# Altium project Main_PCB_EDR.PrjPcb
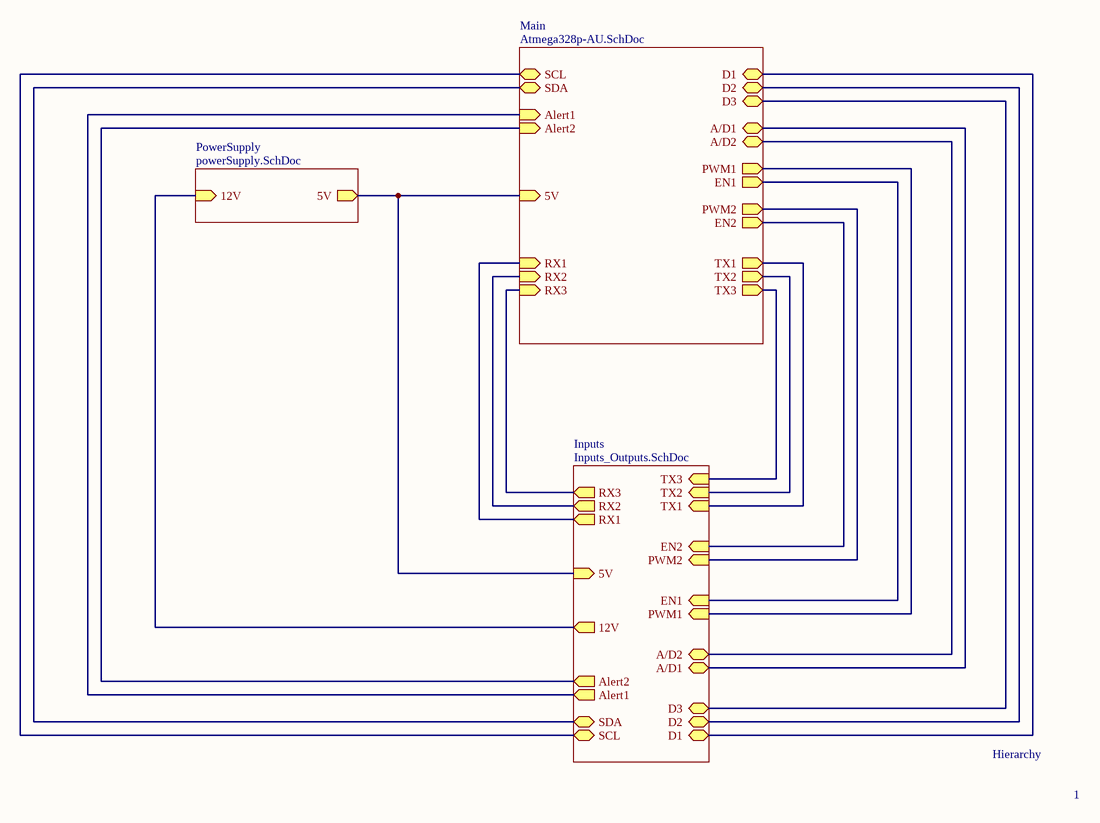
[diagram p0: Hierarchy.SchDoc]
4 sheets, 28 parts. Net scope: hierarchical (ports join the sheet entries above them; power ports are global).
Board file: PCB2.PcbDoc
Sheets:
  Hierarchy.SchDoc
    Main = Atmega328p-AU.SchDoc
    PowerSupply = powerSupply.SchDoc
    Inputs = Inputs_Outputs.SchDoc

## Sheet Hierarchy.SchDoc
size A4; SheetNumber: 1; SheetTotal: 4

### Sub-sheets
Inputs = Inputs_Outputs.SchDoc: Alert1 (out), Alert2 (out), 12V (out), SCL (bidir), SDA (bidir), TX3 (in), TX2 (in), TX1 (in), EN2 (in), PWM2 (in), EN1 (in), PWM1 (in), A/D2 (bidir), A/D1 (bidir), D3 (bidir), D2 (bidir), D1 (bidir), 5V (in), RX1 (out), RX2 (out), RX3 (out)
Main = Atmega328p-AU.SchDoc: PWM1 (out), EN1 (out), PWM2 (out), EN2 (out), 5V (in), Alert1 (in), Alert2 (in), SCL (bidir), SDA (bidir), RX1 (in), RX2 (in), RX3 (in), TX1 (out), TX2 (out), TX3 (out), D2 (bidir), D3 (bidir), D1 (bidir), A/D1 (bidir), A/D2 (bidir)
PowerSupply = powerSupply.SchDoc: 5V (out), 12V (in)

### Nets
+5: sheet Main/5V, sheet PowerSupply/5V, sheet Inputs/5V
NetA/D_1: sheet Main/A/D1, sheet Inputs/A/D1
NetA/D_2: sheet Main/A/D2, sheet Inputs/A/D2
NetC2_1: sheet PowerSupply/12V, sheet Inputs/12V
Netcurrent_sensor_1_1: sheet Main/SCL, sheet Inputs/SCL
Netcurrent_sensor_1_2: sheet Main/SDA, sheet Inputs/SDA
Netcurrent_sensor_1_3: sheet Main/Alert1, sheet Inputs/Alert1
Netcurrent_sensor_2_3: sheet Main/Alert2, sheet Inputs/Alert2
NetDigital_1: sheet Main/D1, sheet Inputs/D1
NetDigital_2: sheet Main/D2, sheet Inputs/D2
NetDigital_3: sheet Main/D3, sheet Inputs/D3
NetH-Bridge1_1: sheet Main/PWM1, sheet Inputs/PWM1
NetH-Bridge1_2: sheet Main/EN1, sheet Inputs/EN1
NetH-Bridge2_1: sheet Main/PWM2, sheet Inputs/PWM2
NetH-Bridge2_2: sheet Main/EN2, sheet Inputs/EN2
NetIC1_23: sheet Main/RX1, sheet Inputs/RX1
NetIC1_24: sheet Main/TX1, sheet Inputs/TX1
NetIC1_25: sheet Main/RX2, sheet Inputs/RX2
NetIC1_26: sheet Main/TX2, sheet Inputs/TX2
NetIC1_30: sheet Main/RX3, sheet Inputs/RX3
NetIC1_31: sheet Main/TX3, sheet Inputs/TX3

### Notes on the sheet
- Hierarchy
- 1

## Sheet Atmega328p-AU.SchDoc
size A4; SheetNumber: 2; SheetTotal: 4
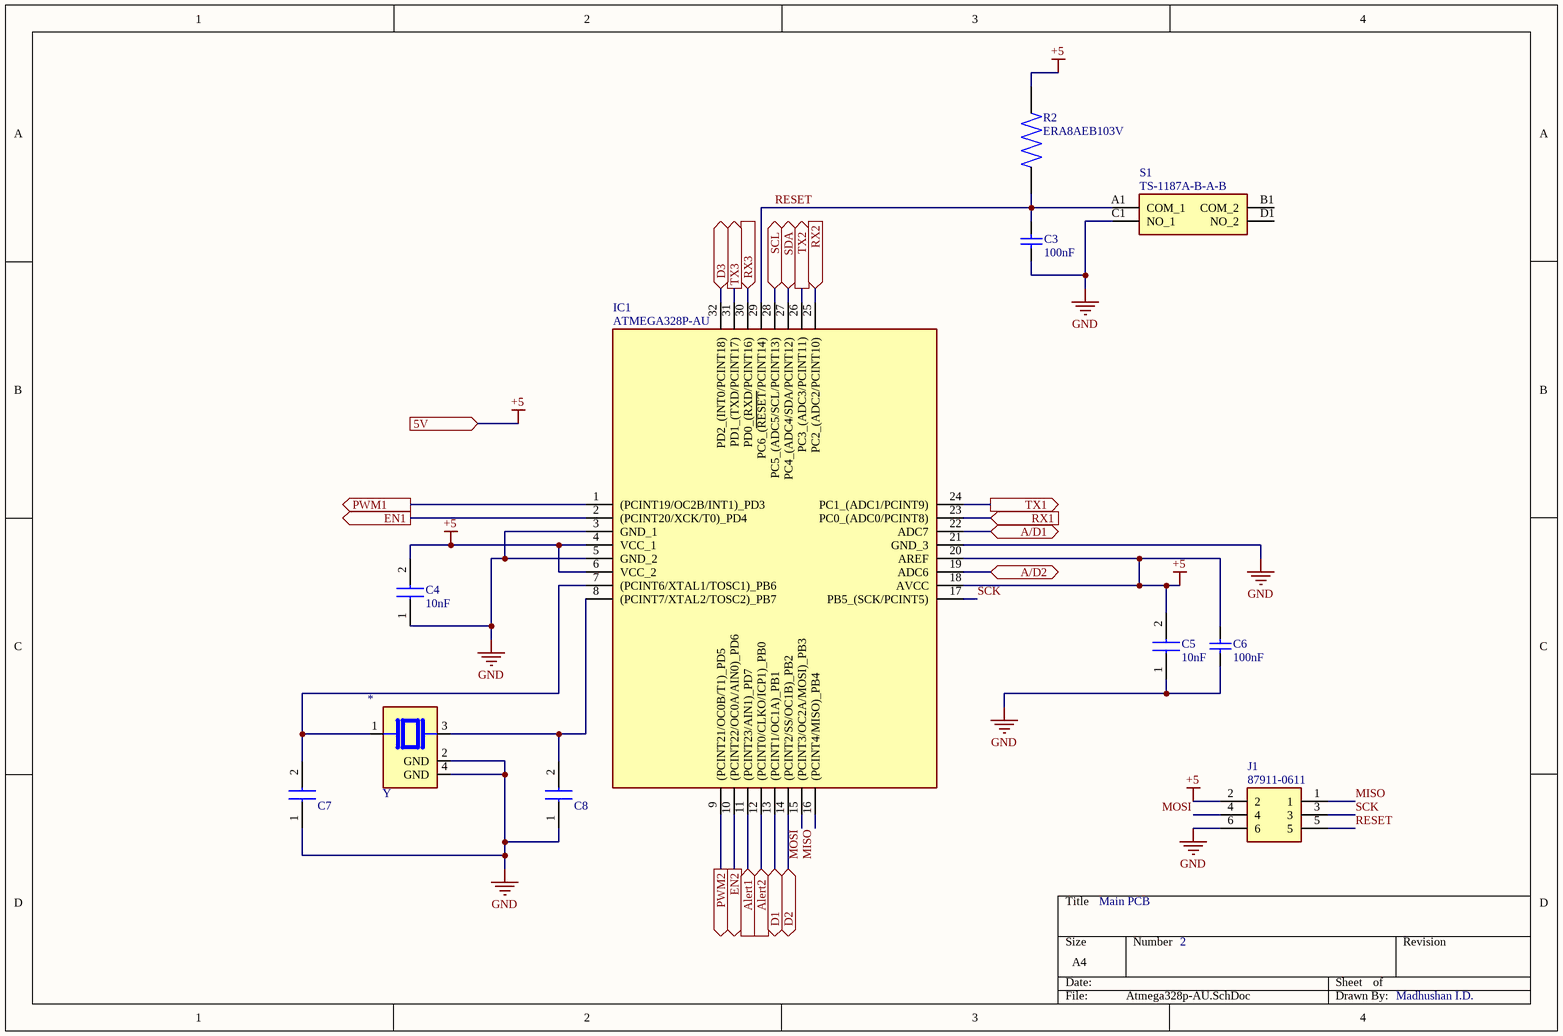
[diagram p1: Atmega328p-AU.SchDoc]

### Parts
C3  Capacitance: 100nF  [AVX-1206-2_L]  (hidden comment: 1206GC102KAT1A)
C4  10nF  [CAPC3216X94N]
C5  10nF  [CAPC3216X94N]
C6  Capacitance: 100nF  [AVX-1206-2_L]  (hidden comment: 1206GC102KAT1A)
C7  C1206C220JGGACTU (22pF)  [C1206]  (value not drawn)
C8  C1206C220JGGACTU (22pF)  [C1206]  (value not drawn)
IC1  ATMEGA328P-AU  [QFP80P900X900X120-32N]
J1  87911-0611  [879110611]
R2  ERA8AEB103V  [RES_ERA8AEB103V]
S1  TS-1187A-B-A-B  [TS1187ABAB]
Y  ABM11-16.000MHz-12-N1G-T  [XTAL_ABM11-16.000MHz-12-N1G-T]  (value not drawn)

### Ports
5V (in, see Hierarchy[2B], Inputs_Outputs[2C], powerSupply[3B]), A/D1 (bidir, see Hierarchy[3B], Inputs_Outputs[3C]), A/D2 (bidir, see Hierarchy[3B], Inputs_Outputs[3C]), Alert1 (in, see Hierarchy[2B], Inputs_Outputs[2B]), Alert2 (in, see Hierarchy[2B], Inputs_Outputs[2B]), D1 (bidir, see Hierarchy[3A], Inputs_Outputs[3C]), D2 (bidir, see Hierarchy[3A], Inputs_Outputs[3C]), D3 (bidir, see Hierarchy[3A], Inputs_Outputs[3C]), EN1 (out, see Hierarchy[3B], Inputs_Outputs[3B]), EN2 (out, see Hierarchy[3B], Inputs_Outputs[3B]), PWM1 (out, see Hierarchy[3B], Inputs_Outputs[3B]), PWM2 (out, see Hierarchy[3B], Inputs_Outputs[3B]), RX1 (in, see Hierarchy[2B], Inputs_Outputs[2C]), RX2 (in, see Hierarchy[2B], Inputs_Outputs[2C]), RX3 (in, see Hierarchy[2B], Inputs_Outputs[2D]), SCL (bidir, see Hierarchy[2A], Inputs_Outputs[2B]), SDA (bidir, see Hierarchy[2A], Inputs_Outputs[2B]), TX1 (out, see Hierarchy[3B], Inputs_Outputs[2C]), TX2 (out, see Hierarchy[3B], Inputs_Outputs[2C]), TX3 (out, see Hierarchy[3B], Inputs_Outputs[2D])

### Nets
+5: C4.2 C5.2 C6.2 IC1.4(VCC_1) IC1.6(VCC_2) IC1.18(AVCC) IC1.20(AREF) J1.2 R2.2 ; port 5V
GND: C3.1 C4.1 C5.1 C6.1 C7.1 C8.1 IC1.3(GND_1) IC1.5(GND_2) IC1.21(GND_3) J1.6 S1.C1(NO_1) Y.2(GND) Y.4(GND)
MISO: IC1.16((PCINT4/MISO)_PB4) J1.1
MOSI: IC1.15((PCINT3/OC2A/MOSI)_PB3) J1.4
RESET: C3.2 IC1.29(PC6_(~{RESET}/PCINT14)) J1.5 R2.1 S1.A1(COM_1)
SCK: IC1.17(PB5_(SCK/PCINT5)) J1.3
NetA/D_1: IC1.22(ADC7) ; port A/D1
NetA/D_2: IC1.19(ADC6) ; port A/D2
NetC7_2: C7.2 IC1.7((PCINT6/XTAL1/TOSC1)_PB6) Y.1
NetC8_2: C8.2 IC1.8((PCINT7/XTAL2/TOSC2)_PB7) Y.3
Netcurrent_sensor_1_1: IC1.28(PC5_(ADC5/SCL/PCINT13)) ; port SCL
Netcurrent_sensor_1_2: IC1.27(PC4_(ADC4/SDA/PCINT12)) ; port SDA
Netcurrent_sensor_1_3: IC1.11((PCINT23/AIN1)_PD7) ; port Alert1
Netcurrent_sensor_2_3: IC1.12((PCINT0/CLKO/ICP1)_PB0) ; port Alert2
NetDigital_1: IC1.13((PCINT1/OC1A)_PB1) ; port D1
NetDigital_2: IC1.14((PCINT2/SS/OC1B)_PB2) ; port D2
NetDigital_3: IC1.32(PD2_(INT0/PCINT18)) ; port D3
NetH-Bridge1_1: IC1.1((PCINT19/OC2B/INT1)_PD3) ; port PWM1
NetH-Bridge1_2: IC1.2((PCINT20/XCK/T0)_PD4) ; port EN1
NetH-Bridge2_1: IC1.9((PCINT21/OC0B/T1)_PD5) ; port PWM2
NetH-Bridge2_2: IC1.10((PCINT22/OC0A/AIN0)_PD6) ; port EN2
NetIC1_23: IC1.23(PC0_(ADC0/PCINT8)) ; port RX1
NetIC1_24: IC1.24(PC1_(ADC1/PCINT9)) ; port TX1
NetIC1_25: IC1.25(PC2_(ADC2/PCINT10)) ; port RX2
NetIC1_26: IC1.26(PC3_(ADC3/PCINT11)) ; port TX2
NetIC1_30: IC1.30(PD0_(RXD/PCINT16)) ; port RX3
NetIC1_31: IC1.31(PD1_(TXD/PCINT17)) ; port TX3

Not connected (* = marked no-connect by the designer): S1 B1(COM_2) D1(NO_2)

### Notes on the sheet
- Main PCB
- 2
- Madhushan I.D.

### Library data of the parts
C3 C6 = CMP-2000-05468-1: Chip Capacitor, 1 nF, +/- 10%, -55 to 125 degC, 1206 (3216 Metric), RoHS, Tape and Reel; Manufacturer: AVX; Dielectric: X7R; Voltage Rating DC: 2000V; Package Reference: 1206; Datasheet Version: 11/2010; Mounting Technology: SurfaceMount; Manufacturer URL: http://www.avx.com/; Tolerance: 10%; Tolerance (%): ±10%; PartNumber: 1206GC102KAT1A; Datasheet URL: https://datasheet.ciiva.com/11787/0900766b80ed4c37-11787781.pdf; Package Description: 2-Pin SMD, Body 3.4 x 1.8 mm; Case Size/Dimension: 1206; Rated Voltage: 2000V
C4 C5 = KAM31BR81H103KT: Capacitor; Manufacturer_Name: Kyocera AVX; Datasheet Link: https://datasheets.kyocera-avx.com/AutoMLCCKAM.pdf; Height: 0.94mm; Manufacturer_Part_Number: KAM31BR81H103KT; Mouser Part Number: 581-KAM31BR81H103KT; Mouser Price/Stock: https://www.mouser.co.uk/ProductDetail/KYOCERA-AVX/KAM31BR81H103KT?qs=Jm2GQyTW%2FbjzijSUJGW%2FJA%3D%3D
C7 C8 = C1206C220JGGACTU: Capacitor; Manufacturer_Name: KEMET; Datasheet Link: https://content.kemet.com/datasheets/KEM_C1009_C0G_HV_SMD.pdf; Manufacturer_Part_Number: C1206C220JGGACTU; Mouser Part Number: 80-C1206C220JGG; Mouser Price/Stock: https://www.mouser.co.uk/ProductDetail/KEMET/C1206C220JGGACTU?qs=bISZhnDGhxtrVzrFMq60vg%3D%3D
IC1 = ATMEGA328P-AU: Integrated Circuit; Manufacturer_Name: Microchip; Datasheet Link: https://componentsearchengine.com/Datasheets/2/ATMEGA328P-AU.pdf; Height: 1.2mm; Manufacturer_Part_Number: ATMEGA328P-AU; Mouser Part Number: 556-ATMEGA328P-AU; Mouser Price/Stock: https://www.mouser.co.uk/ProductDetail/Microchip-Technology/ATMEGA328P-AU?qs=K8BHR703ZXiCmmgp6%2FGNmQ%3D%3D; Arrow Part Number: ATMEGA328P-AU; Arrow Price/Stock: https://www.arrow.com/en/products/atmega328p-au/microchip-technology?region=europe
J1 = 87911-0611: Connector; Manufacturer_Name: Molex; Datasheet Link: https://www.molex.com/content/dam/molex/molex-dot-com/products/automated/en-us/salesdrawingpdf/879/87911/879110611_sd.pdf; Height: 5.18mm; Manufacturer_Part_Number: 87911-0611; Mouser Part Number: 538-87911-0611; Mouser Price/Stock: https://www.mouser.co.uk/ProductDetail/Molex/87911-0611?qs=vTUKd8r8%252BfEYOBWrgoJ4qQ%3D%3D
S1 = TS-1187A-B-A-B: Switch; Manufacturer_Name: XKB Connectivity; Datasheet Link: http://www.helloxkb.com/public/images/pdf/TS-1187A-X-X-X.pdf; Height: 4.05mm; Manufacturer_Part_Number: TS-1187A-B-A-B
Y = ABM11-16.000MHz-12-N1G-T: MF: {'manufacturer': u'Abracon LLC'}; Package: None; Price: None; 16MHz: *; MP: ABM11-16.000MHz-12-N1G-T; Availability: Unavailable
R2 = ERA8AEB103V: Availability: Unavailable; MP: ERA8AEB103V; Price: None; Package: None; Value: *

## Sheet powerSupply.SchDoc
size A4; SheetNumber: 3; SheetTotal: 4
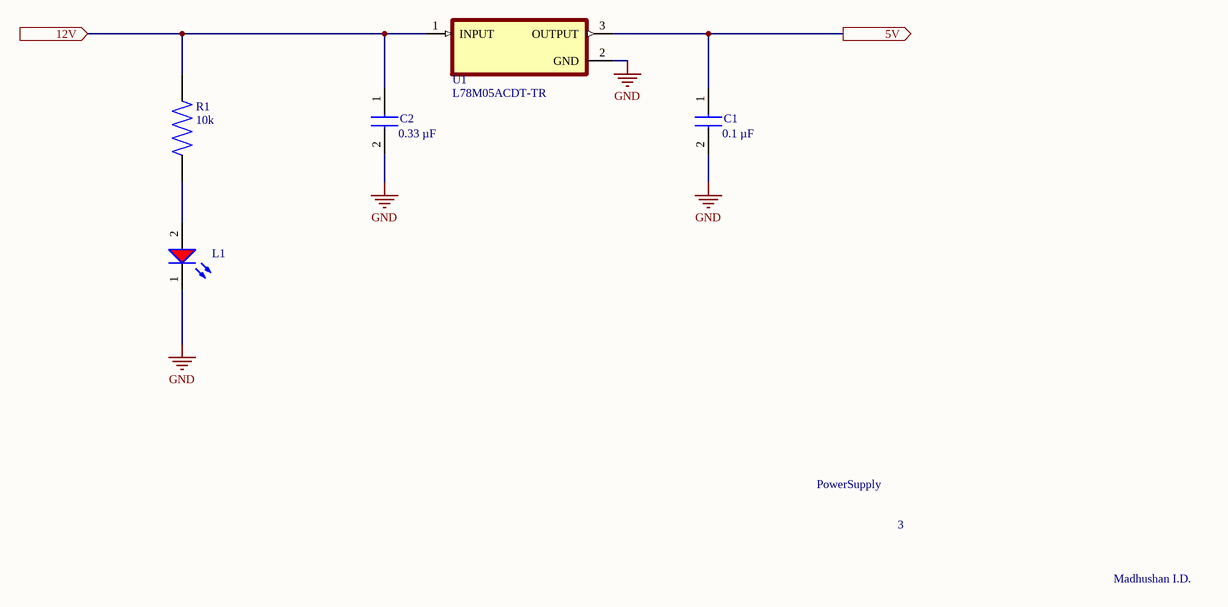
[diagram p2: powerSupply.SchDoc]

### Parts
C1  value 0.1 µF  [C1206]  (hidden comment: C1206C334K1RECAUTO)
C2  Manufacturer_Name: 0.33 µF  [C1206]  (hidden comment: C1206C334K1RECAUTO)
L1  150080SS75000  [WL-SMCW_0805_150080xx75000]  (value not drawn)
R1  value 10k  [RES_ERA8AEB103V]  (hidden comment: ERA8AEB103V)
U1  L78M05ACDT-TR  [DPAK228P972X240-4N]

### Ports
5V (out, see Hierarchy[2B], Atmega328p-AU[2B], Inputs_Outputs[2C]), 12V (in, see Hierarchy[1B], Inputs_Outputs[2A])

### Nets
+5: C1.1 U1.3(OUTPUT) ; port 5V
GND: C1.2 C2.2 L1.1(K) U1.2(GND)
NetC2_1: C2.1 R1.2 U1.1(INPUT) ; port 12V
NetL1_2: L1.2(A) R1.1

### Notes on the sheet
- PowerSupply
- 3
- Madhushan I.D.

### Library data of the parts
C1 = C1206C334K1RECAUTO: Capacitor; Datasheet Link: https://content.kemet.com/datasheets/KEM_C1090_X7R_ESD.pdf; Mouser Part Number: 80-C1206C334K1RECAUT; Mouser Price/Stock: https://www.mouser.co.uk/ProductDetail/KEMET/C1206C334K1RECAUTO?qs=MLItCLRbWsx8dVF2h1wzKg%3D%3D; Arrow Part Number: C1206C334K1RECAUTO; Manufacturer_Part_Number: C1206C334K1RECAUTO
C2 = C1206C334K1RECAUTO: Capacitor; Value: 0.33 µF; Datasheet Link: https://content.kemet.com/datasheets/KEM_C1090_X7R_ESD.pdf; Mouser Part Number: 80-C1206C334K1RECAUT; Mouser Price/Stock: https://www.mouser.co.uk/ProductDetail/KEMET/C1206C334K1RECAUTO?qs=MLItCLRbWsx8dVF2h1wzKg%3D%3D; Arrow Part Number: C1206C334K1RECAUTO; Manufacturer_Part_Number: C1206C334K1RECAUTO
L1 = CMP-1426-00010-3: NexarPartId: 29717782; Peak Wavelength: 645nm; Luminous Intensity: 60mcd; Max Junction Temperature (Tj): 95°C; Wavelength: 630nm; Forward Current: 100mA; Max Reverse Voltage (DC): 5V; Color: Red; Lens Style: Clear, Rectangular; Test Current: 20mA; Power Dissipation: 72mW; Viewing Angle: 140°; Forward Voltage: 1.9V; Case Code (Metric): 2012; Max Operating Temperature: 85°C; Mount: Surface Mount; Height: 700µm; Case/Package: 0805; Min Operating Temperature: -40°C; Reverse Voltage: 5V; RoHS: Compliant; Packaging: Tape and Reel; REACH SVHC: Unknown; Case Code (Imperial): 0805; Length: 2mm; Width: 1.25mm; Dominant Wavelength: 630nm
U1 = L78M05ACDT-TR: Linear Voltage Regulator IC 1 Output 500mA DPAK; MF: STMicroelectronics; Availability: Unavailable; MP: L78M05ACDT-TR; Price: None; Value: *; SnapEDA_Link: https://www.snapeda.com/parts/L78M05ACDT-TR/STMicroelectronics/view-part/274303/?ref=snap; Package: TO-252-3 STMicroelectronics
R1 = ERA8AEB103V: Availability: Unavailable; MP: ERA8AEB103V; Price: None; Package: None

## Sheet Inputs_Outputs.SchDoc
size A4; SheetNumber: 4; SheetTotal: 4
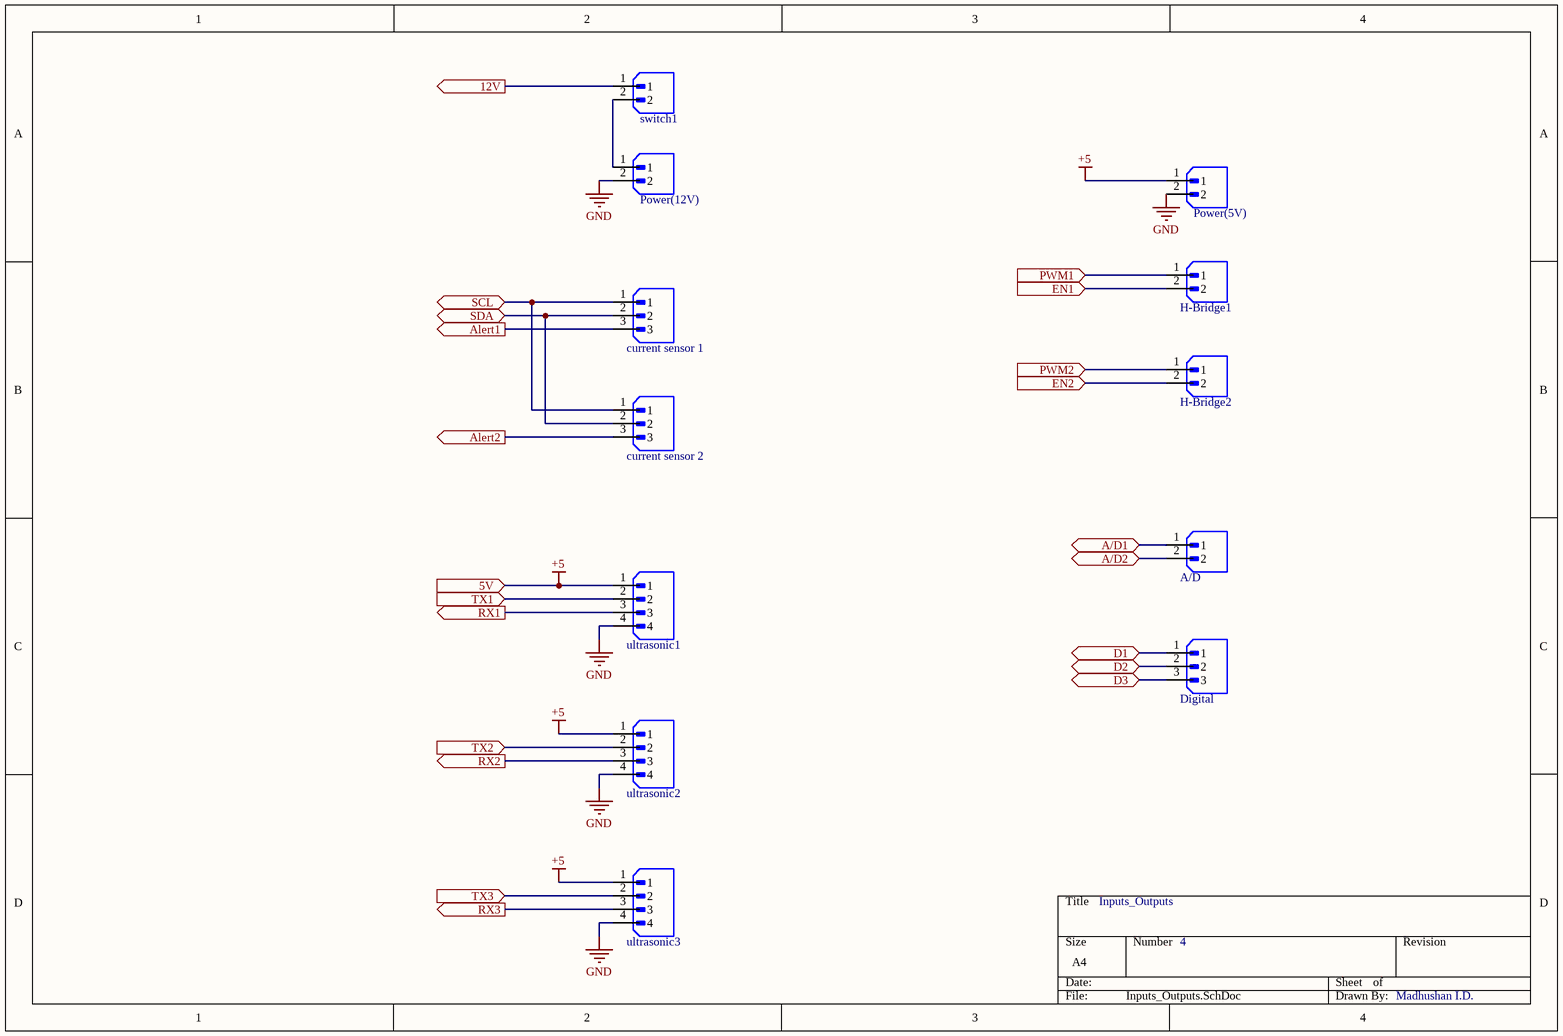
[diagram p3: Inputs_Outputs.SchDoc]

### Parts
A/D  B2B-XH-A  [JST_B2B-XH-A]  (value not drawn)
current_sensor_1  B3B-XH-A(LF)(SN)  [JST_B3B-XH-A(LF)(SN)]  (value not drawn)
current_sensor_2  B3B-XH-A(LF)(SN)  [JST_B3B-XH-A(LF)(SN)]  (value not drawn)
Digital  B3B-XH-A(LF)(SN)  [JST_B3B-XH-A(LF)(SN)]  (value not drawn)
H-Bridge1  B2B-XH-A  [JST_B2B-XH-A]  (value not drawn)
H-Bridge2  B2B-XH-A  [JST_B2B-XH-A]  (value not drawn)
Power(5V)  B2B-XH-A  [JST_B2B-XH-A]  (value not drawn)
Power(12V)  B2B-XH-A  [JST_B2B-XH-A]  (value not drawn)
switch1  B2B-XH-A  [JST_B2B-XH-A]  (value not drawn)
ultrasonic1  B4B-XH-A(LF)(SN)  [JST_B4B-XH-A(LF)(SN)]  (value not drawn)
ultrasonic2  B4B-XH-A(LF)(SN)  [JST_B4B-XH-A(LF)(SN)]  (value not drawn)
ultrasonic3  B4B-XH-A(LF)(SN)  [JST_B4B-XH-A(LF)(SN)]  (value not drawn)

### Ports
5V (in, see Hierarchy[2C], Atmega328p-AU[2B], powerSupply[3B]), 12V (out, see Hierarchy[2D], powerSupply[1B]), A/D1 (bidir, see Hierarchy[3D], Atmega328p-AU[3C]), A/D2 (bidir, see Hierarchy[3D], Atmega328p-AU[3C]), Alert1 (out, see Hierarchy[2D], Atmega328p-AU[2D]), Alert2 (out, see Hierarchy[2D], Atmega328p-AU[2D]), D1 (bidir, see Hierarchy[3D], Atmega328p-AU[2D]), D2 (bidir, see Hierarchy[3D], Atmega328p-AU[3D]), D3 (bidir, see Hierarchy[3D], Atmega328p-AU[2B]), EN1 (in, see Hierarchy[3C], Atmega328p-AU[1C]), EN2 (in, see Hierarchy[3C], Atmega328p-AU[2D]), PWM1 (in, see Hierarchy[3C], Atmega328p-AU[1B]), PWM2 (in, see Hierarchy[3C], Atmega328p-AU[2D]), RX1 (out, see Hierarchy[2C], Atmega328p-AU[3C]), RX2 (out, see Hierarchy[2C], Atmega328p-AU[3B]), RX3 (out, see Hierarchy[2C], Atmega328p-AU[2B]), SCL (bidir, see Hierarchy[2D], Atmega328p-AU[2B]), SDA (bidir, see Hierarchy[2D], Atmega328p-AU[3B]), TX1 (in, see Hierarchy[3C], Atmega328p-AU[3B]), TX2 (in, see Hierarchy[3C], Atmega328p-AU[3B]), TX3 (in, see Hierarchy[3C], Atmega328p-AU[2B])

### Nets
+5: Power(5V).1 ultrasonic1.1 ultrasonic2.1 ultrasonic3.1 ; port 5V
GND: Power(5V).2 Power(12V).2 ultrasonic1.4 ultrasonic2.4 ultrasonic3.4
NetA/D_1: A/D.1 ; port A/D1
NetA/D_2: A/D.2 ; port A/D2
NetC2_1: switch1.1 ; port 12V
Netcurrent_sensor_1_1: current_sensor_1.1 current_sensor_2.1 ; port SCL
Netcurrent_sensor_1_2: current_sensor_1.2 current_sensor_2.2 ; port SDA
Netcurrent_sensor_1_3: current_sensor_1.3 ; port Alert1
Netcurrent_sensor_2_3: current_sensor_2.3 ; port Alert2
NetDigital_1: Digital.1 ; port D1
NetDigital_2: Digital.2 ; port D2
NetDigital_3: Digital.3 ; port D3
NetH-Bridge1_1: H-Bridge1.1 ; port PWM1
NetH-Bridge1_2: H-Bridge1.2 ; port EN1
NetH-Bridge2_1: H-Bridge2.1 ; port PWM2
NetH-Bridge2_2: H-Bridge2.2 ; port EN2
NetIC1_23: ultrasonic1.3 ; port RX1
NetIC1_24: ultrasonic1.2 ; port TX1
NetIC1_25: ultrasonic2.3 ; port RX2
NetIC1_26: ultrasonic2.2 ; port TX2
NetIC1_30: ultrasonic3.3 ; port RX3
NetIC1_31: ultrasonic3.2 ; port TX3
NetPower(12V)_1: Power(12V).1 switch1.2

### Notes on the sheet
- Inputs_Outputs
- 4
- Madhushan I.D.

### Library data of the parts
A/D H-Bridge1 H-Bridge2 Power(5V) Power(12V) switch1 = B2B-XH-A: MF: {'manufacturer': u'JST Sales America Inc.'}; Package: None; Price: None; Value: *; MP: B2B-XH-A; Availability: Unavailable
current_sensor_1 current_sensor_2 Digital = B3B-XH-A(LF)(SN): Connector Header Through Hole 3 position 0.098 (2.50mm); MF: JST Sales; SnapEDA_Link: https://www.snapeda.com/parts/B3B-XH-A(LF)(SN)/JST+Sales+America+Inc./view-part/?ref=snap; Package: None; Value: *; MP: B3B-XH-A(LF)(SN); Check_prices: https://www.snapeda.com/parts/B3B-XH-A(LF)(SN)/JST+Sales+America+Inc./view-part/?ref=eda
ultrasonic1-ultrasonic3 = B4B-XH-A(LF)(SN): Connector Header Through Hole 4 position 0.098 (2.50mm); MF: JST Sales; SnapEDA_Link: https://www.snapeda.com/parts/B4B-XH-A(LF)(SN)/JST+Sales+America+Inc./view-part/?ref=snap; Package: None; Value: *; MP: B4B-XH-A(LF)(SN); Check_prices: https://www.snapeda.com/parts/B4B-XH-A(LF)(SN)/JST+Sales+America+Inc./view-part/?ref=eda

## Nets that join several sheets
+5: Atmega328p-AU (9 pins), powerSupply (C1.1 U1.3), Inputs_Outputs (Power(5V).1 ultrasonic1.1 ultrasonic2.1 ultrasonic3.1)
GND: Atmega328p-AU (13 pins), powerSupply (C1.2 C2.2 L1.1 U1.2), Inputs_Outputs (5 pins)
NetA/D_1: Atmega328p-AU (IC1.22), Inputs_Outputs (A/D.1)
NetA/D_2: Atmega328p-AU (IC1.19), Inputs_Outputs (A/D.2)
NetC2_1: powerSupply (C2.1 R1.2 U1.1), Inputs_Outputs (switch1.1)
Netcurrent_sensor_1_1: Atmega328p-AU (IC1.28), Inputs_Outputs (current_sensor_1.1 current_sensor_2.1)
Netcurrent_sensor_1_2: Atmega328p-AU (IC1.27), Inputs_Outputs (current_sensor_1.2 current_sensor_2.2)
Netcurrent_sensor_1_3: Atmega328p-AU (IC1.11), Inputs_Outputs (current_sensor_1.3)
Netcurrent_sensor_2_3: Atmega328p-AU (IC1.12), Inputs_Outputs (current_sensor_2.3)
NetDigital_1: Atmega328p-AU (IC1.13), Inputs_Outputs (Digital.1)
NetDigital_2: Atmega328p-AU (IC1.14), Inputs_Outputs (Digital.2)
NetDigital_3: Atmega328p-AU (IC1.32), Inputs_Outputs (Digital.3)
NetH-Bridge1_1: Atmega328p-AU (IC1.1), Inputs_Outputs (H-Bridge1.1)
NetH-Bridge1_2: Atmega328p-AU (IC1.2), Inputs_Outputs (H-Bridge1.2)
NetH-Bridge2_1: Atmega328p-AU (IC1.9), Inputs_Outputs (H-Bridge2.1)
NetH-Bridge2_2: Atmega328p-AU (IC1.10), Inputs_Outputs (H-Bridge2.2)
NetIC1_23: Atmega328p-AU (IC1.23), Inputs_Outputs (ultrasonic1.3)
NetIC1_24: Atmega328p-AU (IC1.24), Inputs_Outputs (ultrasonic1.2)
NetIC1_25: Atmega328p-AU (IC1.25), Inputs_Outputs (ultrasonic2.3)
NetIC1_26: Atmega328p-AU (IC1.26), Inputs_Outputs (ultrasonic2.2)
NetIC1_30: Atmega328p-AU (IC1.30), Inputs_Outputs (ultrasonic3.3)
NetIC1_31: Atmega328p-AU (IC1.31), Inputs_Outputs (ultrasonic3.2)